# EAGLE schematic stereo_mix_back_digital (EAGLE 9.5.1)

## Sheet 1 of 3: Channels
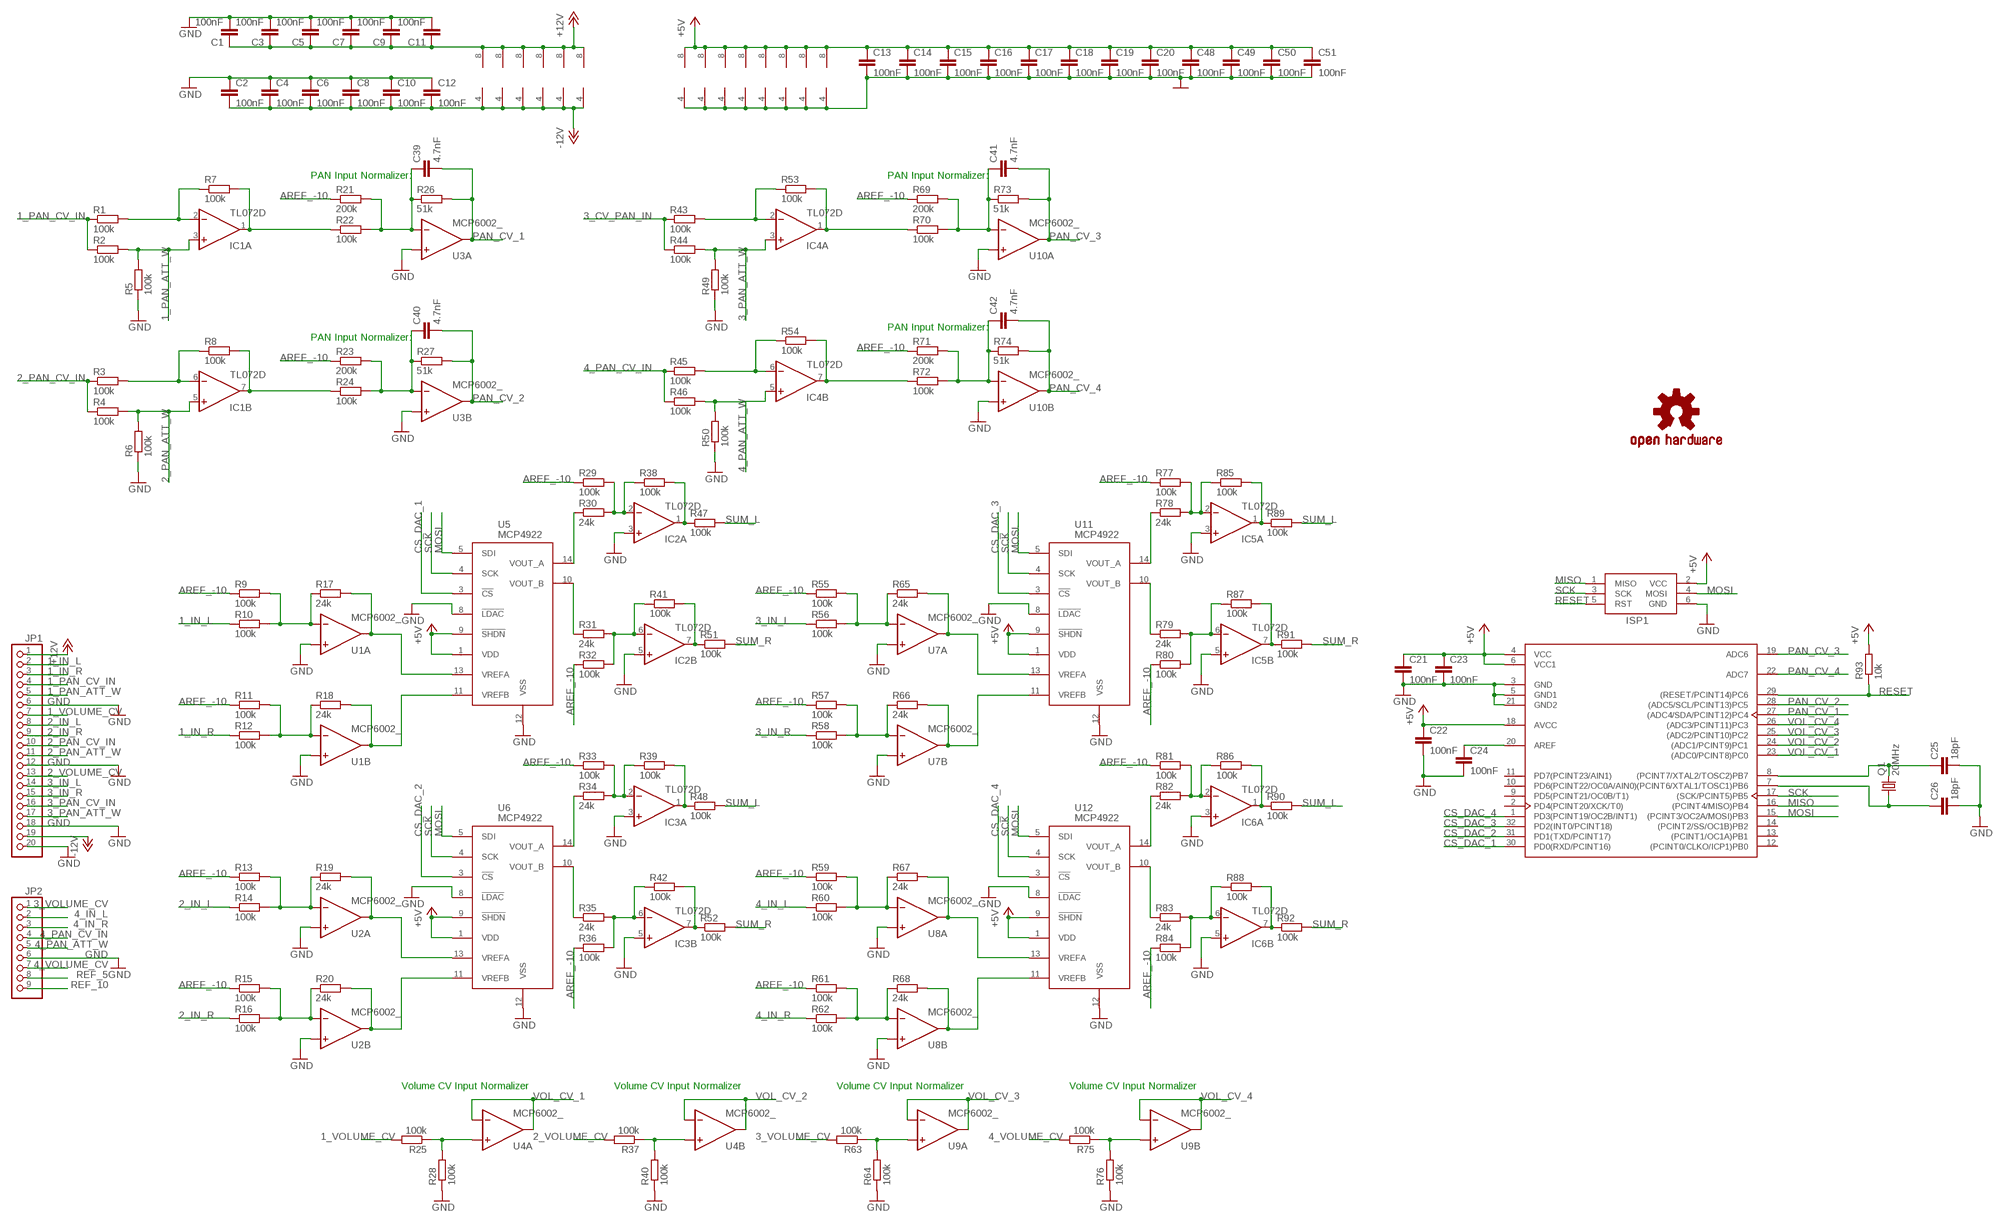
[diagram p0: schematic, sheet 1]

### Parts
C1  100nF  C-EUC0402  [C0402]
C2  100nF  C-EUC0402  [C0402]
C3  100nF  C-EUC0402  [C0402]
C4  100nF  C-EUC0402  [C0402]
C5  100nF  C-EUC0402  [C0402]
C6  100nF  C-EUC0402  [C0402]
C7  100nF  C-EUC0402  [C0402]
C8  100nF  C-EUC0402  [C0402]
C9  100nF  C-EUC0402  [C0402]
C10  100nF  C-EUC0402  [C0402]
C11  100nF  C-EUC0402  [C0402]
C12  100nF  C-EUC0402  [C0402]
C13  100nF  C-EUC0402  [C0402]
C14  100nF  C-EUC0402  [C0402]
C15  100nF  C-EUC0402  [C0402]
C16  100nF  C-EUC0402  [C0402]
C17  100nF  C-EUC0402  [C0402]
C18  100nF  C-EUC0402  [C0402]
C19  100nF  C-EUC0402  [C0402]
C20  100nF  C-EUC0402  [C0402]
C21  100nF  C-EUC0402  [C0402]
C22  100nF  C-EUC0402  [C0402]
C23  100nF  C-EUC0402  [C0402]
C24  100nF  C-EUC0402  [C0402]
C25  18pF  C-EUC0402  [C0402]
C26  18pF  C-EUC0402  [C0402]
C39  4.7nF  C-EUC0402  [C0402]
C40  4.7nF  C-EUC0402  [C0402]
C41  4.7nF  C-EUC0402  [C0402]
C42  4.7nF  C-EUC0402  [C0402]
C48  100nF  C-EUC0402  [C0402]
C49  100nF  C-EUC0402  [C0402]
C50  100nF  C-EUC0402  [C0402]
C51  100nF  C-EUC0402  [C0402]
IC1  TL072D  [SO08]
IC2  TL072D  [SO08]
IC3  TL072D  [SO08]
IC4  TL072D  [SO08]
IC5  TL072D  [SO08]
IC6  TL072D  [SO08]
ISP1  AVRISP-6  [AVRISP]
JP1  PINHD-1X20  [1X20]
JP2  PINHD-1X9  [1X09]
LOGO1  OSHW-LOGOS  [OSHW-LOGO-S]
Q1  20MHz  CRYSTALHC49UP  [HC49UP]
R1  100k  R-EU_R0402  [R0402]
R2  100k  R-EU_R0402  [R0402]
R3  100k  R-EU_R0402  [R0402]
R4  100k  R-EU_R0402  [R0402]
R5  100k  R-EU_R0402  [R0402]
R6  100k  R-EU_R0402  [R0402]
R7  100k  R-EU_R0402  [R0402]
R8  100k  R-EU_R0402  [R0402]
R9  100k  R-EU_R0402  [R0402]
R10  100k  R-EU_R0402  [R0402]
R11  100k  R-EU_R0402  [R0402]
R12  100k  R-EU_R0402  [R0402]
R13  100k  R-EU_R0402  [R0402]
R14  100k  R-EU_R0402  [R0402]
R15  100k  R-EU_R0402  [R0402]
R16  100k  R-EU_R0402  [R0402]
R17  24k  R-EU_R0402  [R0402]
R18  24k  R-EU_R0402  [R0402]
R19  24k  R-EU_R0402  [R0402]
R20  24k  R-EU_R0402  [R0402]
R21  200k  R-EU_R0402  [R0402]
R22  100k  R-EU_R0402  [R0402]
R23  200k  R-EU_R0402  [R0402]
R24  100k  R-EU_R0402  [R0402]
R25  100k  R-EU_R0402  [R0402]
R26  51k  R-EU_R0402  [R0402]
R27  51k  R-EU_R0402  [R0402]
R28  100k  R-EU_R0402  [R0402]
R29  100k  R-EU_R0402  [R0402]
R30  24k  R-EU_R0402  [R0402]
R31  24k  R-EU_R0402  [R0402]
R32  100k  R-EU_R0402  [R0402]
R33  100k  R-EU_R0402  [R0402]
R34  24k  R-EU_R0402  [R0402]
R35  24k  R-EU_R0402  [R0402]
R36  100k  R-EU_R0402  [R0402]
R37  100k  R-EU_R0402  [R0402]
R38  100k  R-EU_R0402  [R0402]
R39  100k  R-EU_R0402  [R0402]
R40  100k  R-EU_R0402  [R0402]
R41  100k  R-EU_R0402  [R0402]
R42  100k  R-EU_R0402  [R0402]
R43  100k  R-EU_R0402  [R0402]
R44  100k  R-EU_R0402  [R0402]
R45  100k  R-EU_R0402  [R0402]
R46  100k  R-EU_R0402  [R0402]
R47  100k  R-EU_R0402  [R0402]
R48  100k  R-EU_R0402  [R0402]
R49  100k  R-EU_R0402  [R0402]
R50  100k  R-EU_R0402  [R0402]
R51  100k  R-EU_R0402  [R0402]
R52  100k  R-EU_R0402  [R0402]
R53  100k  R-EU_R0402  [R0402]
R54  100k  R-EU_R0402  [R0402]
R55  100k  R-EU_R0402  [R0402]
R56  100k  R-EU_R0402  [R0402]
R57  100k  R-EU_R0402  [R0402]
R58  100k  R-EU_R0402  [R0402]
R59  100k  R-EU_R0402  [R0402]
R60  100k  R-EU_R0402  [R0402]
R61  100k  R-EU_R0402  [R0402]
R62  100k  R-EU_R0402  [R0402]
R63  100k  R-EU_R0402  [R0402]
R64  100k  R-EU_R0402  [R0402]
R65  24k  R-EU_R0402  [R0402]
R66  24k  R-EU_R0402  [R0402]
R67  24k  R-EU_R0402  [R0402]
R68  24k  R-EU_R0402  [R0402]
R69  200k  R-EU_R0402  [R0402]
R70  100k  R-EU_R0402  [R0402]
R71  200k  R-EU_R0402  [R0402]
R72  100k  R-EU_R0402  [R0402]
R73  51k  R-EU_R0402  [R0402]
R74  51k  R-EU_R0402  [R0402]
R75  100k  R-EU_R0402  [R0402]
R76  100k  R-EU_R0402  [R0402]
R77  100k  R-EU_R0402  [R0402]
R78  24k  R-EU_R0402  [R0402]
R79  24k  R-EU_R0402  [R0402]
R80  100k  R-EU_R0402  [R0402]
R81  100k  R-EU_R0402  [R0402]
R82  24k  R-EU_R0402  [R0402]
R83  24k  R-EU_R0402  [R0402]
R84  100k  R-EU_R0402  [R0402]
R85  100k  R-EU_R0402  [R0402]
R86  100k  R-EU_R0402  [R0402]
R87  100k  R-EU_R0402  [R0402]
R88  100k  R-EU_R0402  [R0402]
R89  100k  R-EU_R0402  [R0402]
R90  100k  R-EU_R0402  [R0402]
R91  100k  R-EU_R0402  [R0402]
R92  100k  R-EU_R0402  [R0402]
R93  10k  R-EU_R0402  [R0402]
U1  MCP6002_  [SO08]
U2  MCP6002_  [SO08]
U3  MCP6002_  [SO08]
U4  MCP6002_  [SO08]
U5  MCP4922  [SO-14]
U6  MCP4922  [SO-14]
U7  MCP6002_  [SO08]
U8  MCP6002_  [SO08]
U9  MCP6002_  [SO08]
U10  MCP6002_  [SO08]
U11  MCP4922  [SO-14]
U12  MCP4922  [SO-14]
U13  ATMEGA328P-AU  [TQFP-32]

### Nets
1_IN_L: JP1.2 R10.1
1_IN_R: JP1.3 R12.1
1_PAN_ATT_W: IC1.3(A:+IN) JP1.5 R2.2 R5.2
1_PAN_CV_IN: JP1.4 R1.1 R2.1
1_VOLUME_CV: JP1.7 R25.2
2_IN_L: JP1.8 R14.1
2_IN_R: JP1.9 R16.1
2_PAN_ATT_W: IC1.5(B:+IN) JP1.11 R4.2 R6.2
2_PAN_CV_IN: JP1.10 R3.1 R4.1
2_VOLUME_CV: JP1.13 R37.2
3_CV_PAN_IN: R43.1 R44.1
3_IN_L: JP1.14 R56.1
3_IN_R: JP1.15 R58.1
3_PAN_ATT_W: IC4.3(A:+IN) JP1.17 R44.2 R49.2
3_PAN_CV_IN: JP1.16
3_VOLUME_CV: JP2.1 R63.2
4_IN_L: JP2.2 R60.1
4_IN_R: JP2.3 R62.1
4_PAN_ATT_W: IC4.5(B:+IN) JP2.5 R46.2 R50.2
4_PAN_CV_IN: JP2.4 R45.1 R46.1
4_VOLUME_CV: JP2.7 R75.2
+5V [power]: C13.1 C14.1 C15.1 C16.1 C17.1 C18.1 C19.1 C20.1 C21.1 C22.1 C23.1 C48.1 C49.1 C50.1 C51.1 ISP1.2(VCC) R93.2 U1.8(P:V+) U2.8(P:V+) U3.8(P:V+) U4.8(P:V+) U5.1(VDD) U5.9(!SHDN) U6.1(VDD) U6.9(!SHDN) U7.8(P:V+) U8.8(P:V+) U9.8(P:V+) U10.8(P:V+) U11.1(VDD) U11.9(!SHDN) U12.1(VDD) U12.9(!SHDN) U13.4(VCC) U13.6(VCC1) U13.18(AVCC) ; also sheet 3
+12V [power]: C1.1 C3.1 C5.1 C7.1 C9.1 C11.1 IC1.8(P:V+) IC2.8(P:V+) IC3.8(P:V+) IC4.8(P:V+) IC5.8(P:V+) IC6.8(P:V+) JP1.1 ; also sheet 2,3
-12V [power]: C2.2 C4.2 C6.2 C8.2 C10.2 C12.2 IC1.4(P:V-) IC2.4(P:V-) IC3.4(P:V-) IC4.4(P:V-) IC5.4(P:V-) IC6.4(P:V-) JP1.19 ; also sheet 2,3
AREF_-10: R9.1 R11.1 R13.1 R15.1 R21.1 R23.1 R29.1 R32.1 R33.1 R36.1 R55.1 R57.1 R59.1 R61.1 R69.1 R71.1 R77.1 R80.1 R81.1 R84.1 ; also sheet 3
CS_DAC_1: U5.3(!CS) U13.30(PD0(RXD/PCINT16))
CS_DAC_2: U6.3(!CS) U13.31(PD1(TXD/PCINT17))
CS_DAC_3: U11.3(!CS) U13.32(PD2(INT0/PCINT18))
CS_DAC_4: U12.3(!CS) U13.1(PD3(PCINT19/OC2B/INT1))
GND [power]: C1.2 C2.1 C3.2 C4.1 C5.2 C6.1 C7.2 C8.1 C9.2 C10.1 C11.2 C12.1 C13.2 C14.2 C15.2 C16.2 C17.2 C18.2 C19.2 C20.2 C21.2 C22.2 C23.2 C24.2 C25.2 C26.2 C48.2 C49.2 C50.2 C51.2 IC2.3(A:+IN) IC2.5(B:+IN) IC3.3(A:+IN) IC3.5(B:+IN) IC5.3(A:+IN) IC5.5(B:+IN) IC6.3(A:+IN) IC6.5(B:+IN) ISP1.6(GND) JP1.6 JP1.12 JP1.18 JP1.20 JP2.6 R5.1 R6.1 R28.1 R40.1 R49.1 R50.1 R64.1 R76.1 U1.3(A:+IN) U1.4(P:V-) U1.5(B:+IN) U2.3(A:+IN) U2.4(P:V-) U2.5(B:+IN) U3.3(A:+IN) U3.4(P:V-) U3.5(B:+IN) U4.4(P:V-) U5.8(!LDAC) U5.12(VSS) U6.8(!LDAC) U6.12(VSS) U7.3(A:+IN) U7.4(P:V-) U7.5(B:+IN) U8.3(A:+IN) U8.4(P:V-) U8.5(B:+IN) U9.4(P:V-) U10.3(A:+IN) U10.4(P:V-) U10.5(B:+IN) U11.8(!LDAC) U11.12(VSS) U12.8(!LDAC) U12.12(VSS) U13.3(GND) U13.5(GND1) U13.21(GND2) ; also sheet 2,3
MISO: ISP1.1(MISO) U13.16((PCINT4/MISO)PB4)
MOSI: ISP1.4(MOSI) U5.5(SDI) U6.5(SDI) U11.5(SDI) U12.5(SDI) U13.15((PCINT3/OC2A/MOSI)PB3)
N$1: R30.1 U5.14(VOUT_A)
N$2: R11.2 R12.2 R18.1 U1.6(B:-IN)
N$3: IC2.2(A:-IN) R29.2 R30.2 R38.1
N$4: R17.2 U1.1(A:OUT) U5.13(VREFA)
N$5: R18.2 U1.7(B:OUT) U5.11(VREFB)
N$6: R9.2 R10.2 R17.1 U1.2(A:-IN)
N$7: IC2.7(B:OUT) R41.2 R51.1
N$8: IC2.1(A:OUT) R38.2 R47.1
N$9: IC2.6(B:-IN) R31.2 R32.2 R41.1
N$10: R31.1 U5.10(VOUT_B)
N$11: C25.1 Q1.2 U13.8((PCINT7/XTAL2/TOSC2)PB7)
N$12: C39.1 R21.2 R22.2 R26.1 U3.2(A:-IN)
N$13: IC1.1(A:OUT) R7.2 R22.1
N$15: R25.1 R28.2 U4.3(A:+IN)
N$17: R37.1 R40.2 U4.5(B:+IN)
N$18: IC1.2(A:-IN) R1.2 R7.1
N$19: R15.2 R16.2 R20.1 U2.6(B:-IN)
N$20: R20.2 U2.7(B:OUT) U6.11(VREFB)
N$21: R19.2 U2.1(A:OUT) U6.13(VREFA)
N$22: R13.2 R14.2 R19.1 U2.2(A:-IN)
N$23: R34.1 U6.14(VOUT_A)
N$24: IC3.2(A:-IN) R33.2 R34.2 R39.1
N$25: IC3.1(A:OUT) R39.2 R48.1
N$26: IC3.6(B:-IN) R35.2 R36.2 R42.1
N$27: R35.1 U6.10(VOUT_B)
N$28: IC3.7(B:OUT) R42.2 R52.1
N$29: R57.2 R58.2 R66.1 U7.6(B:-IN)
N$30: R66.2 U7.7(B:OUT) U11.11(VREFB)
N$31: R65.2 U7.1(A:OUT) U11.13(VREFA)
N$33: R55.2 R56.2 R65.1 U7.2(A:-IN)
N$34: R78.1 U11.14(VOUT_A)
N$35: IC5.2(A:-IN) R77.2 R78.2 R85.1
N$36: IC5.1(A:OUT) R85.2 R89.1
N$37: IC5.6(B:-IN) R79.2 R80.2 R87.1
N$38: R79.1 U11.10(VOUT_B)
N$39: IC5.7(B:OUT) R87.2 R91.1
N$40: R61.2 R62.2 R68.1 U8.6(B:-IN)
N$41: R68.2 U8.7(B:OUT) U12.11(VREFB)
N$42: C40.1 R23.2 R24.2 R27.1 U3.6(B:-IN)
N$44: R67.2 U8.1(A:OUT) U12.13(VREFA)
N$46: R59.2 R60.2 R67.1 U8.2(A:-IN)
N$49: R82.1 U12.14(VOUT_A)
N$50: IC6.2(A:-IN) R81.2 R82.2 R86.1
N$51: IC6.1(A:OUT) R86.2 R90.1
N$52: IC6.6(B:-IN) R83.2 R84.2 R88.1
N$53: R83.1 U12.10(VOUT_B)
N$54: IC6.7(B:OUT) R88.2 R92.1
N$56: IC1.7(B:OUT) R8.2 R24.1
N$57: IC1.6(B:-IN) R3.2 R8.1
N$58: C24.1 U13.20(AREF)
N$59: C41.1 R69.2 R70.2 R73.1 U10.2(A:-IN)
N$60: IC4.1(A:OUT) R53.2 R70.1
N$61: IC4.2(A:-IN) R43.2 R53.1
N$62: C26.1 Q1.1 U13.7((PCINT6/XTAL1/TOSC1)PB6)
N$63: C42.1 R71.2 R72.2 R74.1 U10.6(B:-IN)
N$64: IC4.7(B:OUT) R54.2 R72.1
N$65: IC4.6(B:-IN) R45.2 R54.1
N$66: R63.1 R64.2 U9.3(A:+IN)
N$69: R75.1 R76.2 U9.5(B:+IN)
PAN_CV_1: C39.2 R26.2 U3.1(A:OUT) U13.27((ADC4/SDA/PCINT12)PC4)
PAN_CV_2: C40.2 R27.2 U3.7(B:OUT) U13.28((ADC5/SCL/PCINT13)PC5)
PAN_CV_3: C41.2 R73.2 U10.1(A:OUT) U13.19(ADC6)
PAN_CV_4: C42.2 R74.2 U10.7(B:OUT) U13.22(ADC7)
REF_5: JP2.8 ; also sheet 3
REF_10: JP2.9 ; also sheet 3
RESET: ISP1.5(RST) R93.1 U13.29((RESET/PCINT14)PC6)
SCK: ISP1.3(SCK) U5.4(SCK) U6.4(SCK) U11.4(SCK) U12.4(SCK) U13.17((SCK/PCINT5)PB5)
SUM_L: R47.2 R48.2 R89.2 R90.2 ; also sheet 2
SUM_R: R51.2 R52.2 R91.2 R92.2 ; also sheet 2
VOL_CV_1: U4.1(A:OUT) U4.2(A:-IN) U13.23((ADC0/PCINT8)PC0)
VOL_CV_2: U4.6(B:-IN) U4.7(B:OUT) U13.24((ADC1/PCINT9)PC1)
VOL_CV_3: U9.1(A:OUT) U9.2(A:-IN) U13.25((ADC2/PCINT10)PC2)
VOL_CV_4: U9.6(B:-IN) U9.7(B:OUT) U13.26((ADC3/PCINT11)PC3)
Unconnected: U13.2(PD4(PCINT20/XCK/T0)) U13.9(PD5(PCINT21/OC0B/T1)) U13.10(PD6(PCINT22/OC0A/AIN0)) U13.11(PD7(PCINT23/AIN1)) U13.12((PCINT0/CLKO/ICP1)PB0) U13.13((PCINT1/OC1A)PB1) U13.14((PCINT2/SS/OC1B)PB2)

### Notes on the sheet
- PAN Input Normalizer: | PAN Input Normalizer:
- PAN Input Normalizer:
- PAN Input Normalizer:
- Volume CV Input Normalizer | Volume CV Input Normalizer | Volume CV Input Normalizer | Volume CV Input Normalizer

## Sheet 2 of 3: Output
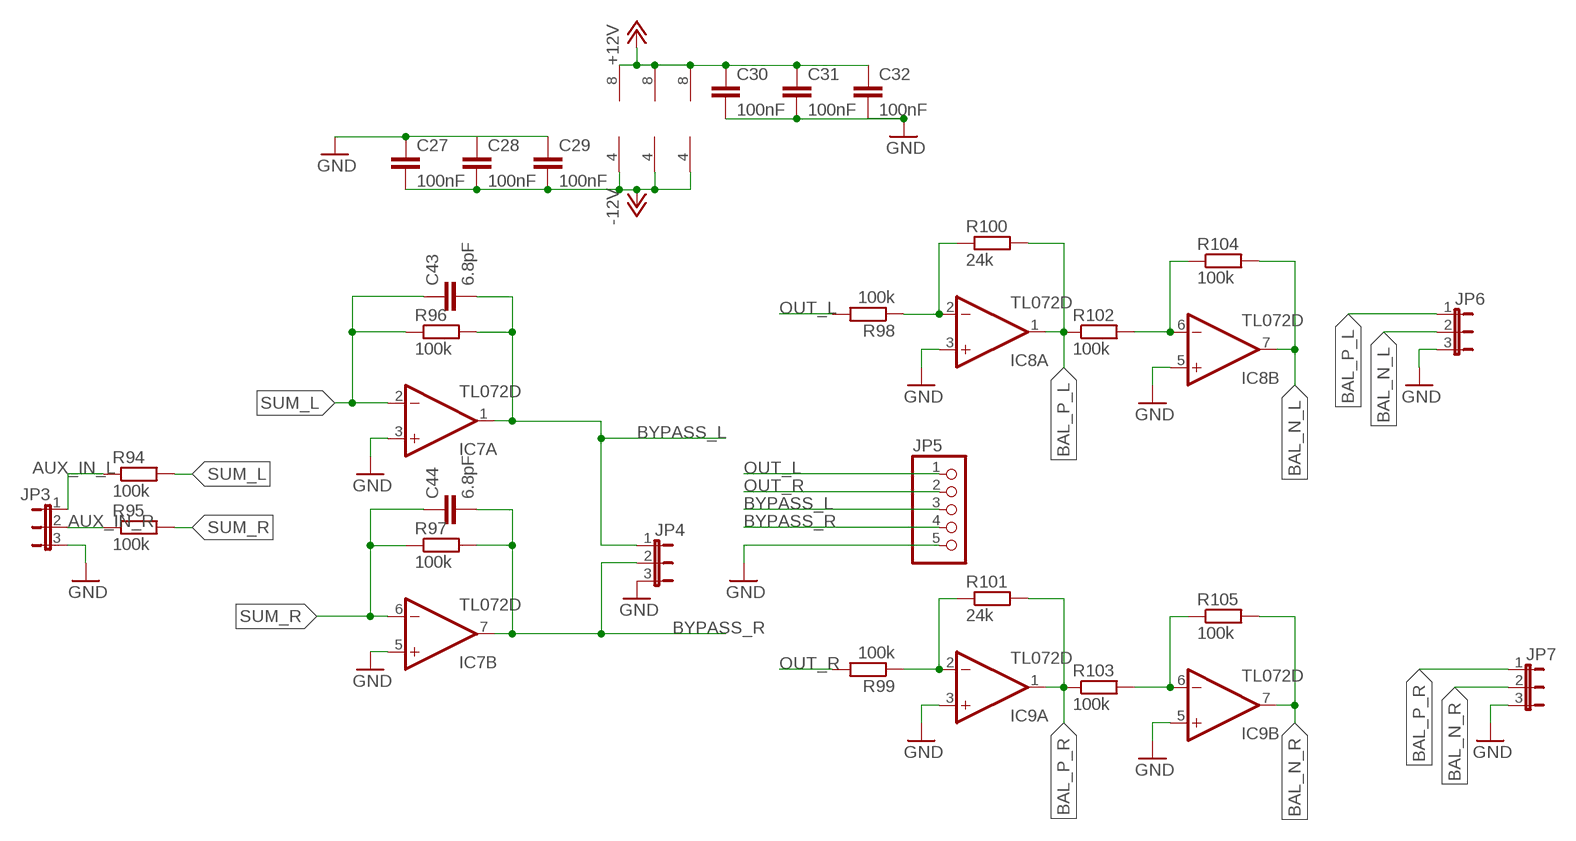
[diagram p1: schematic, sheet 2]

### Parts
C27  100nF  C-EUC0402  [C0402]
C28  100nF  C-EUC0402  [C0402]
C29  100nF  C-EUC0402  [C0402]
C30  100nF  C-EUC0402  [C0402]
C31  100nF  C-EUC0402  [C0402]
C32  100nF  C-EUC0402  [C0402]
C43  6.8pF  C-EUC0402  [C0402]
C44  6.8pF  C-EUC0402  [C0402]
IC7  TL072D  [SO08]
IC8  TL072D  [SO08]
IC9  TL072D  [SO08]
JP3  JP2E  [JP2]
JP4  JP2E  [JP2]
JP5  PINHD-1X5  [1X05]
JP6  JP2E  [JP2]
JP7  JP2E  [JP2]
R94  100k  R-EU_R0402  [R0402]
R95  100k  R-EU_R0402  [R0402]
R96  100k  R-EU_R0402  [R0402]
R97  100k  R-EU_R0402  [R0402]
R98  100k  R-EU_R0402  [R0402]
R99  100k  R-EU_R0402  [R0402]
R100  24k  R-EU_R0402  [R0402]
R101  24k  R-EU_R0402  [R0402]
R102  100k  R-EU_R0402  [R0402]
R103  100k  R-EU_R0402  [R0402]
R104  100k  R-EU_R0402  [R0402]
R105  100k  R-EU_R0402  [R0402]

### Nets
+12V [power]: C30.1 C31.1 C32.1 IC7.8(P:V+) IC8.8(P:V+) IC9.8(P:V+) ; also sheet 1,3
-12V [power]: C27.2 C28.2 C29.2 IC7.4(P:V-) IC8.4(P:V-) IC9.4(P:V-) ; also sheet 1,3
AUX_IN_L: JP3.1 R94.1
AUX_IN_R: JP3.2 R95.1
BAL_N_L: IC8.7(B:OUT) JP6.2 R104.2
BAL_N_R: IC9.7(B:OUT) JP7.2 R105.2
BAL_P_L: IC8.1(A:OUT) JP6.1 R100.2 R102.1
BAL_P_R: IC9.1(A:OUT) JP7.1 R101.2 R103.1
BYPASS_L: C43.2 IC7.1(A:OUT) JP4.1 JP5.3 R96.2
BYPASS_R: C44.2 IC7.7(B:OUT) JP4.2 JP5.4 R97.2
GND [power]: C27.1 C28.1 C29.1 C30.2 C31.2 C32.2 IC7.3(A:+IN) IC7.5(B:+IN) IC8.3(A:+IN) IC8.5(B:+IN) IC9.3(A:+IN) IC9.5(B:+IN) JP3.3 JP4.3 JP5.5 JP6.3 JP7.3 ; also sheet 1,3
N$32: IC8.2(A:-IN) R98.1 R100.1
N$43: IC9.6(B:-IN) R103.2 R105.1
N$45: IC8.6(B:-IN) R102.2 R104.1
N$55: IC9.2(A:-IN) R99.1 R101.1
OUT_L: JP5.1 R98.2
OUT_R: JP5.2 R99.2
SUM_L: C43.1 IC7.2(A:-IN) R94.2 R96.1 ; also sheet 1
SUM_R: C44.1 IC7.6(B:-IN) R95.2 R97.1 ; also sheet 1

## Sheet 3 of 3: Power
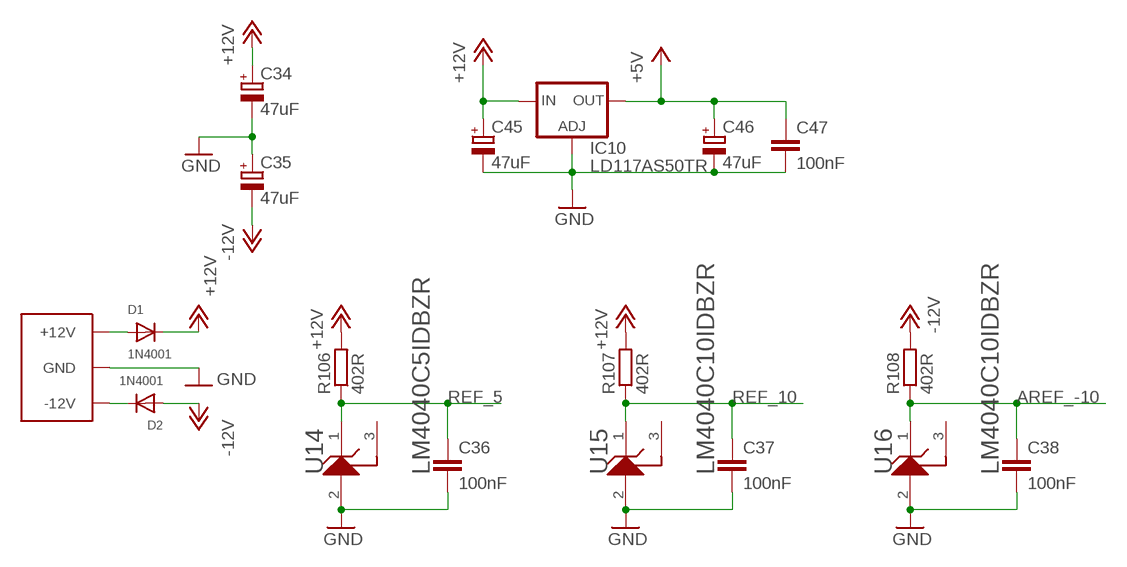
[diagram p2: schematic, sheet 3]

### Parts
C33  EURO_POWER_LOCKFAT-LOCK  [EURO_PWR_HEADER_LOCK]
C34  47uF  CPOL-EUC  [PANASONIC_C]
C35  47uF  CPOL-EUC  [PANASONIC_C]
C36  100nF  C-EUC0402  [C0402]
C37  100nF  C-EUC0402  [C0402]
C38  100nF  C-EUC0402  [C0402]
C45  47uF  CPOL-EUC  [PANASONIC_C]
C46  47uF  CPOL-EUC  [PANASONIC_C]
C47  100nF  C-EUC0402  [C0402]
D1  1N4001  DIODESMA  [SMADIODE]
D2  1N4001  DIODESMA  [SMADIODE]
IC10  LD117AS50TR  [SOT223]
R106  402R  R-EU_R0402  [R0402]
R107  402R  R-EU_R0402  [R0402]
R108  402R  R-EU_R0402  [R0402]
U14  TEXAS_INSTRUMENTS_LM4040C5IDBZR  [TEXAS_INSTRUMENTS_LM4040C5IDBZR_0]
U15  TEXAS_INSTRUMENTS_LM4040C10IDBZR  [TEXAS_INSTRUMENTS_LM4040C5IDBZR_0]
U16  TEXAS_INSTRUMENTS_LM4040C10IDBZR  [TEXAS_INSTRUMENTS_LM4040C5IDBZR_0]

### Nets
+5V [power]: C46.+ C47.1 IC10.4(OUT) ; also sheet 1
+12V [power]: C34.+ C45.+ D1.C IC10.3(IN) R106.2 R107.2 ; also sheet 1,2
-12V [power]: C35.- D2.A R108.2 ; also sheet 1,2
AREF_-10: C38.1 R108.1 U16.1(CATHODE) ; also sheet 1
GND [power]: C33.GND1(GND) C33.GND2(GND) C33.GND3(GND) C33.GND4(GND) C33.GND5(GND) C33.GND6(GND) C34.- C35.+ C36.2 C37.2 C38.2 C45.- C46.- C47.2 IC10.1(ADJ) U14.2(ANODE) U15.2(ANODE) U16.2(ANODE) ; also sheet 1,2
N$47 [power]: C33.POS1(+12V) C33.POS2(+12V) D1.A
N$48 [power]: C33.NEG1(-12V) C33.NEG2(-12V) D2.C
REF_5: C36.1 R106.1 U14.1(CATHODE) ; also sheet 1
REF_10: C37.1 R107.1 U15.1(CATHODE) ; also sheet 1
Unconnected: U14.3(NC) U15.3(NC) U16.3(NC)

## Library data of the parts
C1-C32 C36-C44 C47-C51 = resistor:C-EU: CAPACITOR, European symbol
C33 = MusicThingModular:EURO_POWER_LOCK
C34 C35 C45 C46 = rcl:CPOL-EU: POLARIZED CAPACITOR, European symbol; SPICEPREFIX: C
D1 D2 = adafruit:DIODE: Diode SMADIODE - SMA Surface Mount Package 20V 1A Schottky Diode Digikey: 641-1014-6-ND DO-1N4148 - Through Hole Small Current Diode SOD-123 20V 1 A (.5mV Vf) Schottky Diode - Digikey: MBRX120TPMSCT-ND SOD-323 10V 570mA (.38mV Vf, 3ns) Schottky Diode - Digikey: ZLLS410CT-ND SOD-523 30V 30mA Schottky Diode (RB751S-40TE61) - Digikey: RB751S-40TE61CT-ND SOT23-R/W - SOT23 Package (R = Solder Paste/Reflow Ovens, W = Hand-Soldering) BAT54Film 40V 300mA - Digikey: 497-7162-1-ND
IC1-IC9 = linear:TL072: OP AMP
IC10 = v-reg:LD117A?*: Low drop fixed and adjustable positive voltage regulators 1 A Source: http://www.st.com/stonline/products/literature/ds/7194/ld1117axx.pdf
ISP1 = adafruit:AVRISP: AVR ISP HEADER Standard 6 pin header for AVR programming
JP1 = pinhead:PINHD-1X20: PIN HEADER
JP2 = pinhead:PINHD-1X9: PIN HEADER
JP3 JP4 JP6 JP7 = jumper:JP2E: JUMPER
JP5 = pinhead:PINHD-1X5: PIN HEADER
LOGO1 = SparkFun-Aesthetics:OSHW-LOGO: Open-Source Hardware (OSHW) Logo This logo indicates the piece of hardware it is found on incorporates a OSHW license and/or adheres to the definition of open source hardware found here: http://freedomdefined.org/OSHW
Q1 = crystal:CRYSTAL: CRYSTAL; OC_FARNELL: unknown; OC_NEWARK: unknown
R1-R108 = resistor:R-EU_: RESISTOR, European symbol
U1-U4 U7-U10 = MusicThingModular:MCP6002: Generic Dual Op Amp
U5 U6 U11 U12 = MCP4922:MCP4922: MCP4922 - 12bit DAC, SPI interface Datasheet: http://ww1.microchip.com/downloads/en/DeviceDoc/22250A.pdf
U13 = Microcontroller:ATMEGA328P-AU: IC MCU 8BIT 32KB FLASH 32TQFP Manufacturer's datasheet <http://ww1.microchip.com/downloads/en/DeviceDoc/ATmega48A-PA-88A-PA-168A-PA-328-P-DS-DS40002061A.pdf>; CREATED_BY: PCBLayout.com; DIGIKEY_PART_NUMBER: ATMEGA328P-AU-ND; MANUFACTURER: Microchip Technology; MPN: ATMEGA328P-AU; PACKAGE: TQFP-32
U14 = lm4040:TEXAS_INSTRUMENTS_LM4040C5IDBZR: TI-LM4040C25DBZ3
U15 U16 = lm4040:TEXAS_INSTRUMENTS_LM4040C10IDBZR: TI-LM4040C25DBZ3

## Net classes
0 default: width 0.254 mm
1 power: width 0.406 mm